# Altium schematic sheet CW340_USERIO_Header.SchDoc: User GPIO Headers
size Letter; Organization: NewAE Technology Inc.; Address1: 1083 Queen St., Suite 196; Address2: Halifax; Address3: NS; Address4: Canada B3H 0B2; DocumentNumber: .; Revision: .; SheetNumber: 26; SheetTotal: 31; SheetApproved: Yes
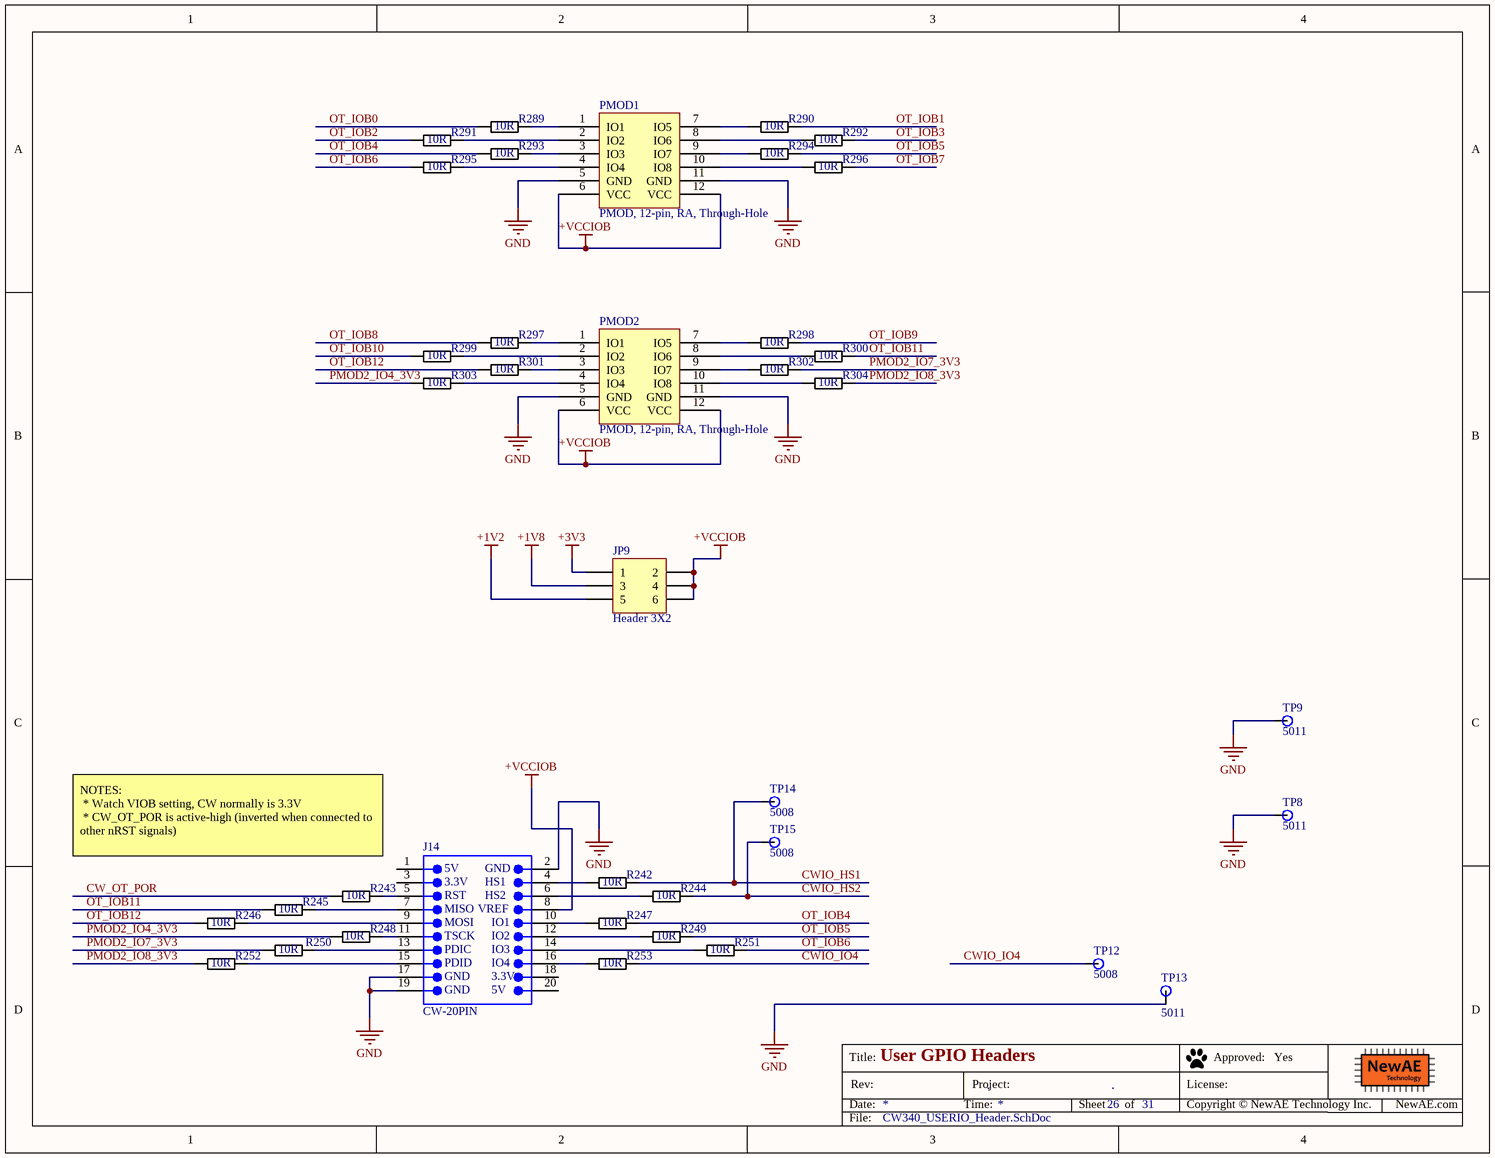
[diagram p0: CW340_USERIO_Header.SchDoc]

## Parts
J14  CW-20PIN  [CONN_10x2_SHROUDED_2.54mm]
JP9  Header 3X2  [HDR2X3]
PMOD1  PMOD, 12-pin, RA, Through-Hole  [SAMTEC_SSW_106_02_X_D_RA_PMOD]
PMOD2  PMOD, 12-pin, RA, Through-Hole  [SAMTEC_SSW_106_02_X_D_RA_PMOD]
R242  10R  [RESC1005X40N]
R243  10R  [RESC1005X40N]
R244  10R  [RESC1005X40N]
R245  10R  [RESC1005X40N]
R246  10R  [RESC1005X40N]
R247  10R  [RESC1005X40N]
R248  10R  [RESC1005X40N]
R249  10R  [RESC1005X40N]
R250  10R  [RESC1005X40N]
R251  10R  [RESC1005X40N]
R252  10R  [RESC1005X40N]
R253  10R  [RESC1005X40N]
R289  10R  [RESC1005X40N]
R290  10R  [RESC1005X40N]
R291  10R  [RESC1005X40N]
R292  10R  [RESC1005X40N]
R293  10R  [RESC1005X40N]
R294  10R  [RESC1005X40N]
R295  10R  [RESC1005X40N]
R296  10R  [RESC1005X40N]
R297  10R  [RESC1005X40N]
R298  10R  [RESC1005X40N]
R299  10R  [RESC1005X40N]
R300  10R  [RESC1005X40N]
R301  10R  [RESC1005X40N]
R302  10R  [RESC1005X40N]
R303  10R  [RESC1005X40N]
R304  10R  [RESC1005X40N]
TP8  5011  [KEYSTONE5011]
TP9  5011  [KEYSTONE5011]
TP12  5008  [KEYSTONE5008]
TP13  5011  [KEYSTONE5011]
TP14  5008  [KEYSTONE5008]
TP15  5008  [KEYSTONE5008]

## Nets
+1V2: JP9.5
+1V8: JP9.3
+3V3: JP9.1
+VCCIOB: J14.8 JP9.2 JP9.4 JP9.6 PMOD1.6(VCC) PMOD1.12(VCC) PMOD2.6(VCC) PMOD2.12(VCC)
GND: J14.2 J14.17 J14.19 PMOD1.5(GND) PMOD1.11(GND) PMOD2.5(GND) PMOD2.11(GND) TP8.1 TP9.1 TP13.1
CW_OT_POR: R243.1
CWIO_HS1: R242.2 TP14.1
CWIO_HS2: R244.2 TP15.1
CWIO_IO4: R253.2 TP12.1
OT_IOB0: R289.1
OT_IOB1: R290.2
OT_IOB2: R291.1
OT_IOB3: R292.2
OT_IOB4: R247.2 R293.1
OT_IOB5: R249.2 R294.2
OT_IOB6: R251.2 R295.1
OT_IOB7: R296.2
OT_IOB8: R297.1
OT_IOB9: R298.2
OT_IOB10: R299.1
OT_IOB11: R245.1 R300.2
OT_IOB12: R246.1 R301.1
PMOD2_IO4_3V3: R248.1 R303.1
PMOD2_IO7_3V3: R250.1 R302.2
PMOD2_IO8_3V3: R252.1 R304.2
NetJ14_4: J14.4 R242.1
NetJ14_5: J14.5 R243.2
NetJ14_6: J14.6 R244.1
NetJ14_7: J14.7 R245.2
NetJ14_9: J14.9 R246.2
NetJ14_10: J14.10 R247.1
NetJ14_11: J14.11 R248.2
NetJ14_12: J14.12 R249.1
NetJ14_13: J14.13 R250.2
NetJ14_14: J14.14 R251.1
NetJ14_15: J14.15 R252.2
NetJ14_16: J14.16 R253.1
NetPMOD1_1: PMOD1.1(IO1) R289.2
NetPMOD1_2: PMOD1.2(IO2) R291.2
NetPMOD1_3: PMOD1.3(IO3) R293.2
NetPMOD1_4: PMOD1.4(IO4) R295.2
NetPMOD1_7: PMOD1.7(IO5) R290.1
NetPMOD1_8: PMOD1.8(IO6) R292.1
NetPMOD1_9: PMOD1.9(IO7) R294.1
NetPMOD1_10: PMOD1.10(IO8) R296.1
NetPMOD2_1: PMOD2.1(IO1) R297.2
NetPMOD2_2: PMOD2.2(IO2) R299.2
NetPMOD2_3: PMOD2.3(IO3) R301.2
NetPMOD2_4: PMOD2.4(IO4) R303.2
NetPMOD2_7: PMOD2.7(IO5) R298.1
NetPMOD2_8: PMOD2.8(IO6) R300.1
NetPMOD2_9: PMOD2.9(IO7) R302.1
NetPMOD2_10: PMOD2.10(IO8) R304.1

Not connected (* = marked no-connect by the designer): J14 1 3 18 20

## Notes on the sheet
- NOTES:
  * Watch VIOB setting, CW normally is 3.3V
  * CW_OT_POR is active-high (inverted when connected to other nRST signals)
- Title:
- Date:
- Rev:
- Time:
- Project:
- Sheet
- of
- License:
- Copyright © NewAE Technology Inc.
- Approved:
- NewAE.com
- File:
- (in symbol CW20PIN_TH) 5V; GND; 3.3V; HS1; RST; HS2; MISO; VREF; MOSI; IO1; TSCK; IO2; PDIC; IO3; PDID; IO4

## Library data of the parts
J14 = CW20PIN_TH: Component Group: Connector; Part Number: CW20PIN_TH; Pin Count: 20; Component Kind: Standard; Component Type: Standard
JP9 = Header 3X2: Header, 3-Pin, Dual row; LatestRevisionDate: 17-Jul-2002; LatestRevisionNote: Re-released for DXP Platform.; Publisher: Altium Limited
PMOD1 PMOD2 = PMOD_2ROW_FEMALERATH: Component Group: Connector; PP Material Stack: 0; Part Number: PMOD_2ROW_FEMALERATH; Pin Count: 12; Supplier 1: Digi-Key; Supplier Part Number 1: ?????; Component Kind: Standard; Component Type: Standard; PP Rotation: 0; PP Rotation1: 0
R242-R253 R289-R304 = RCHIP-10R-0402: 10R res, 0402, 1%, 1/16W; Manufacture 1: Yageo; Manufacture Part Number 1: RC0402FR-0710RL; Component Group: Resistor; Case-EIA: 0402; Case-Metric: 1005; Rated Power: 0.063W; Rated Voltage: 75VDC; Part Number: RCHIP-10R-0402; Footprint: 0402; Pin Count: 2; Supplier 1: Digi-Key; Supplier Part Number 1: 311-10.0LRCT-ND; Value: 10R; Tolerance: 1%; Mounting Technology: SMT; Temperature Range: -55C to 155C; Component Kind: Standard; Component Type: Standard
TP8 TP9 TP13 = KEYSTONE_5011: TEST POINT PC MULTI PURPOSE BLK; Part Number: KEYSTONE_5011; Component Group: Test Point; Pin Count: 1; Supplier 1: Digi-Key; Supplier Part Number 1: 36-5011-ND; Mounting Technology: Through-hole; Component Kind: Standard; Component Type: Standard
TP12 TP14 TP15 = KEYSTONE_5008: TEST POINT PC COMPACT .063"D ORG; Part Number: KEYSTONE_5008; Component Group: Test Point; Pin Count: 1; Supplier 1: Digi-Key; Supplier Part Number 1: 36-5008-ND; Mounting Technology: Through-hole; Component Kind: Standard; Component Type: Standard